# Altium schematic sheet CM5_Connectors.SchDoc: Example Template
size A4; CompanyName: University of Manchester; Engineer: Sam Walsh; Organization: University of Manchester; Address1: L3, 12a Rodborough Rd; Address2: Frenchs Forest; Address3: NSW; Address4: Australia 2086; DocumentNumber: 1; Revision: 0; SheetNumber: 7; SheetTotal: 8; Scale: Ratio
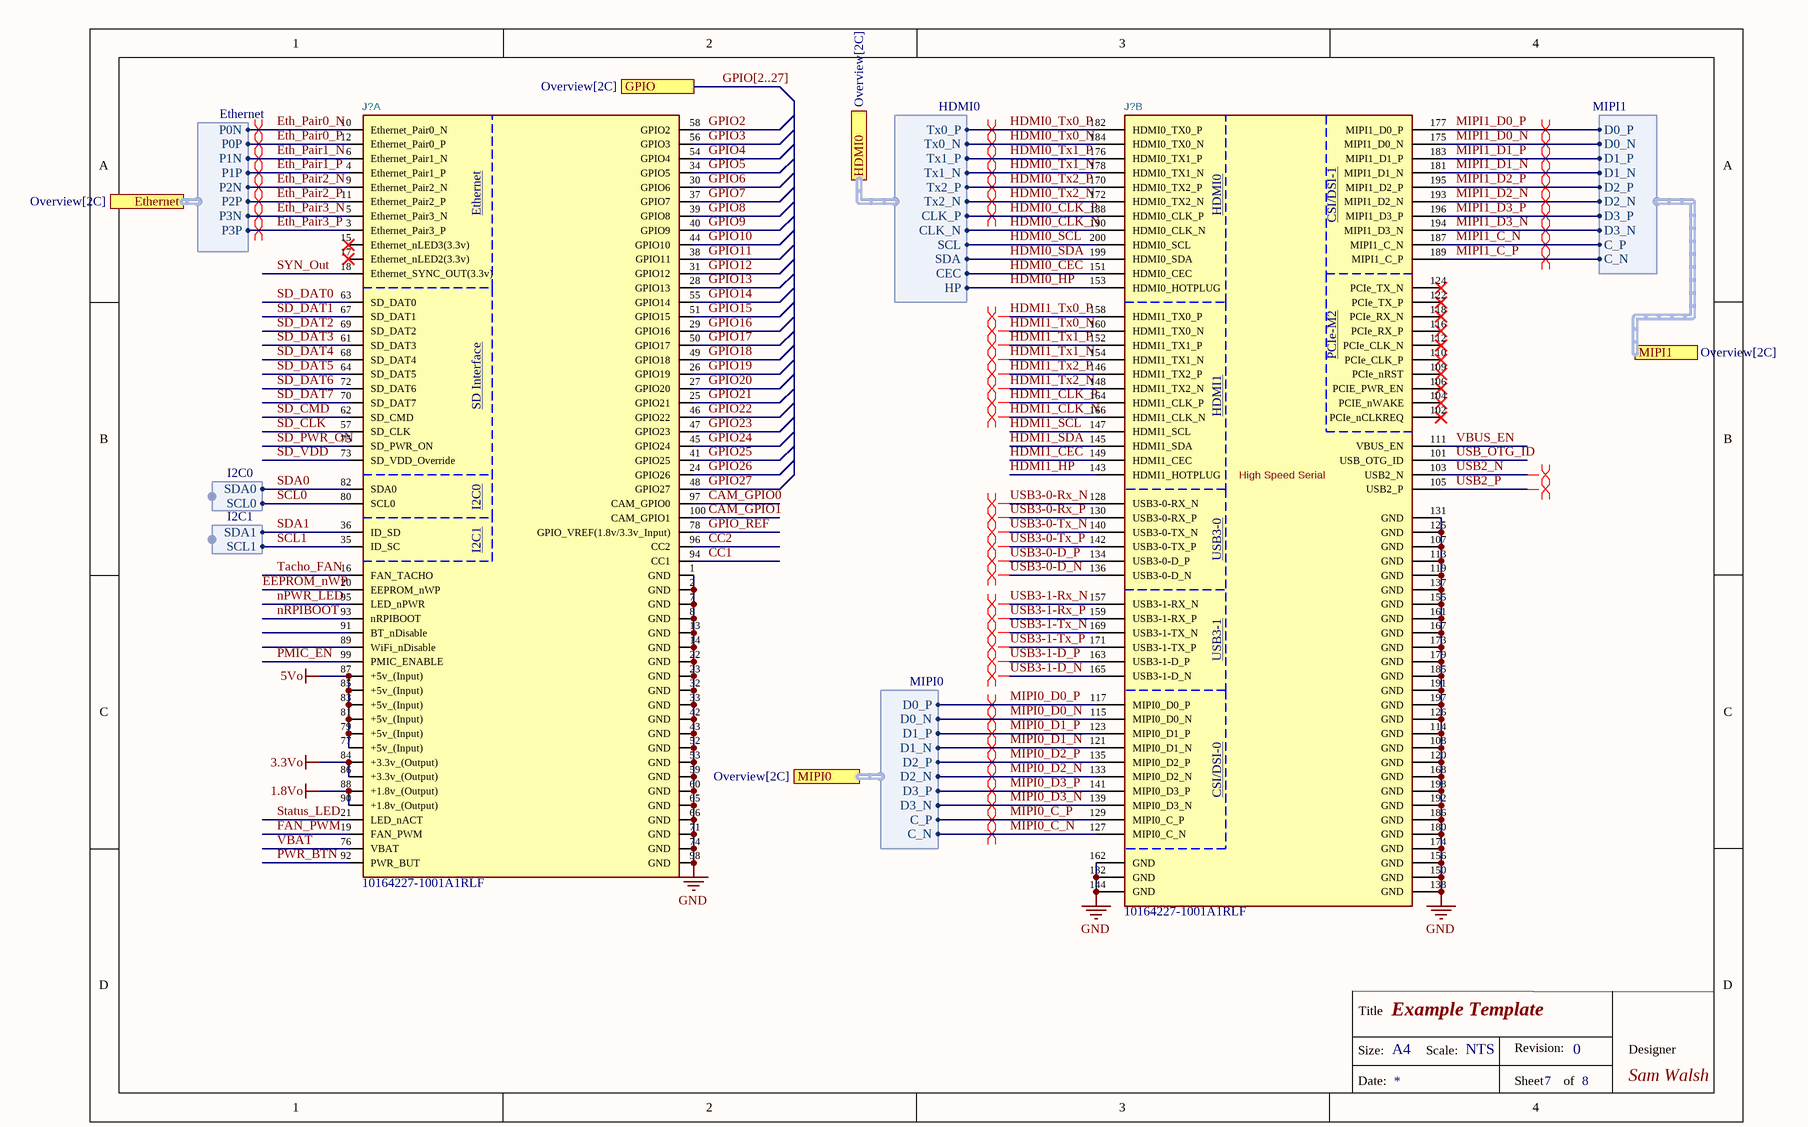
[diagram p0: CM5_Connectors.SchDoc]

## Parts
(Parts that share a designator on the sheet are numbered #1, #2 ... from top to bottom, then left to right.)
J?#1  10164227-1001A1RLF  [Raspberry-Pi-5-Compute-Module]  (part A of 2)
J?#2  10164227-1001A1RLF  [Raspberry-Pi-5-Compute-Module]  (part B of 2)

## Ports
Ethernet (harness Ethernet, see Overview[2C]), GPIO (see Overview[2C]), HDMI0 (harness HDMI0, see Overview[2C]), MIPI0 (harness MIPI0, see Overview[2C]), MIPI1 (harness MIPI1, see Overview[2C])

## Harnesses
MIPI0: D0_P, D0_N, D1_P, D1_N, D2_P, D2_N, D3_P, D3_N, C_P, C_N
MIPI1: D0_P, D0_N, D1_P, D1_N, D2_P, D2_N, D3_P, D3_N, C_P, C_N
HDMI0: Tx0_P, Tx1_N, Tx1_P, Tx2_P, CLK_N, CLK_P, SCL, CEC, HP, Tx2_N, Tx0_N, SDA
I2C0: SDA0, SCL0
I2C1: SDA1, SCL1
Ethernet: P0N, P0P, P1N, P1P, P2N, P2P, P3N, P3P

## Nets
1.8Vo: J?#1.88(+1.8v_(Output)) J?#1.90(+1.8v_(Output))
3.3Vo: J?#1.84(+3.3v_(Output)) J?#1.86(+3.3v_(Output))
5Vo: J?#1.77(+5v_(Input)) J?#1.79(+5v_(Input)) J?#1.81(+5v_(Input)) J?#1.83(+5v_(Input)) J?#1.85(+5v_(Input)) J?#1.87(+5v_(Input))
GND: J?#1.1(GND) J?#1.2(GND) J?#1.7(GND) J?#1.8(GND) J?#1.13(GND) J?#1.14(GND) J?#1.22(GND) J?#1.23(GND) J?#1.32(GND) J?#1.33(GND) J?#1.42(GND) J?#1.43(GND) J?#1.52(GND) J?#1.53(GND) J?#1.59(GND) J?#1.60(GND) J?#1.65(GND) J?#1.66(GND) J?#1.71(GND) J?#1.74(GND) J?#1.98(GND) J?#2.107(GND) J?#2.108(GND) J?#2.113(GND) J?#2.114(GND) J?#2.119(GND) J?#2.120(GND) J?#2.125(GND) J?#2.126(GND) J?#2.131(GND) J?#2.132(GND) J?#2.137(GND) J?#2.138(GND) J?#2.144(GND) J?#2.150(GND) J?#2.155(GND) J?#2.156(GND) J?#2.161(GND) J?#2.162(GND) J?#2.167(GND) J?#2.168(GND) J?#2.173(GND) J?#2.174(GND) J?#2.179(GND) J?#2.180(GND) J?#2.185(GND) J?#2.186(GND) J?#2.191(GND) J?#2.192(GND) J?#2.197(GND) J?#2.198(GND)
CAM_GPIO0: J?#1.97(CAM_GPIO0)
CAM_GPIO1: J?#1.100(CAM_GPIO1)
CC1: J?#1.94(CC1)
CC2: J?#1.96(CC2)
EEPROM_nWP: J?#1.20(EEPROM_nWP)
Eth_Pair0_N: J?#1.10(Ethernet_Pair0_N) ; port Ethernet.P0N
Eth_Pair0_P: J?#1.12(Ethernet_Pair0_P) ; port Ethernet.P0P
Eth_Pair1_N: J?#1.6(Ethernet_Pair1_N) ; port Ethernet.P1N
Eth_Pair1_P: J?#1.4(Ethernet_Pair1_P) ; port Ethernet.P1P
Eth_Pair2_N: J?#1.9(Ethernet_Pair2_N) ; port Ethernet.P2N
Eth_Pair2_P: J?#1.11(Ethernet_Pair2_P) ; port Ethernet.P2P
Eth_Pair3_N: J?#1.5(Ethernet_Pair3_N) ; port Ethernet.P3N
Eth_Pair3_P: J?#1.3(Ethernet_Pair3_P) ; port Ethernet.P3P
FAN_PWM: J?#1.19(FAN_PWM)
GPIO2: J?#1.58(GPIO2)
GPIO3: J?#1.56(GPIO3)
GPIO4: J?#1.54(GPIO4)
GPIO5: J?#1.34(GPIO5)
GPIO6: J?#1.30(GPIO6)
GPIO7: J?#1.37(GPIO7)
GPIO8: J?#1.39(GPIO8)
GPIO9: J?#1.40(GPIO9)
GPIO10: J?#1.44(GPIO10)
GPIO11: J?#1.38(GPIO11)
GPIO12: J?#1.31(GPIO12)
GPIO13: J?#1.28(GPIO13)
GPIO14: J?#1.55(GPIO14)
GPIO15: J?#1.51(GPIO15)
GPIO16: J?#1.29(GPIO16)
GPIO17: J?#1.50(GPIO17)
GPIO18: J?#1.49(GPIO18)
GPIO19: J?#1.26(GPIO19)
GPIO20: J?#1.27(GPIO20)
GPIO21: J?#1.25(GPIO21)
GPIO22: J?#1.46(GPIO22)
GPIO23: J?#1.47(GPIO23)
GPIO24: J?#1.45(GPIO24)
GPIO25: J?#1.41(GPIO25)
GPIO26: J?#1.24(GPIO26)
GPIO27: J?#1.48(GPIO27)
GPIO_REF: J?#1.78(GPIO_VREF(1.8v/3.3v_Input))
HDMI0_CEC: J?#2.151(HDMI0_CEC) ; port HDMI0.CEC
HDMI0_CLK_N: J?#2.190(HDMI0_CLK_N) ; port HDMI0.CLK_N
HDMI0_CLK_P: J?#2.188(HDMI0_CLK_P) ; port HDMI0.CLK_P
HDMI0_HP: J?#2.153(HDMI0_HOTPLUG) ; port HDMI0.HP
HDMI0_SCL: J?#2.200(HDMI0_SCL) ; port HDMI0.SCL
HDMI0_SDA: J?#2.199(HDMI0_SDA) ; port HDMI0.SDA
HDMI0_Tx0_N: J?#2.184(HDMI0_TX0_N) ; port HDMI0.Tx0_N
HDMI0_Tx0_P: J?#2.182(HDMI0_TX0_P) ; port HDMI0.Tx0_P
HDMI0_Tx1_N: J?#2.178(HDMI0_TX1_N) ; port HDMI0.Tx1_N
HDMI0_Tx1_P: J?#2.176(HDMI0_TX1_P) ; port HDMI0.Tx1_P
HDMI0_Tx2_N: J?#2.172(HDMI0_TX2_N) ; port HDMI0.Tx2_N
HDMI0_Tx2_P: J?#2.170(HDMI0_TX2_P) ; port HDMI0.Tx2_P
HDMI1_CEC: J?#2.149(HDMI1_CEC)
HDMI1_CLK_N: J?#2.166(HDMI1_CLK_N)
HDMI1_CLK_P: J?#2.164(HDMI1_CLK_P)
HDMI1_HP: J?#2.143(HDMI1_HOTPLUG)
HDMI1_SCL: J?#2.147(HDMI1_SCL)
HDMI1_SDA: J?#2.145(HDMI1_SDA)
HDMI1_Tx0_N: J?#2.160(HDMI1_TX0_N)
HDMI1_Tx0_P: J?#2.158(HDMI1_TX0_P)
HDMI1_Tx1_N: J?#2.154(HDMI1_TX1_N)
HDMI1_Tx1_P: J?#2.152(HDMI1_TX1_P)
HDMI1_Tx2_N: J?#2.148(HDMI1_TX2_N)
HDMI1_Tx2_P: J?#2.146(HDMI1_TX2_P)
MIPI0_C_N: J?#2.127(MIPI0_C_N) ; port MIPI0.C_N
MIPI0_C_P: J?#2.129(MIPI0_C_P) ; port MIPI0.C_P
MIPI0_D0_N: J?#2.115(MIPI0_D0_N) ; port MIPI0.D0_N
MIPI0_D0_P: J?#2.117(MIPI0_D0_P) ; port MIPI0.D0_P
MIPI0_D1_N: J?#2.121(MIPI0_D1_N) ; port MIPI0.D1_N
MIPI0_D1_P: J?#2.123(MIPI0_D1_P) ; port MIPI0.D1_P
MIPI0_D2_N: J?#2.133(MIPI0_D2_N) ; port MIPI0.D2_N
MIPI0_D2_P: J?#2.135(MIPI0_D2_P) ; port MIPI0.D2_P
MIPI0_D3_N: J?#2.139(MIPI0_D3_N) ; port MIPI0.D3_N
MIPI0_D3_P: J?#2.141(MIPI0_D3_P) ; port MIPI0.D3_P
MIPI1_C_N: J?#2.187(MIPI1_C_N) ; port MIPI1.C_P
MIPI1_C_P: J?#2.189(MIPI1_C_P) ; port MIPI1.C_N
MIPI1_D0_N: J?#2.175(MIPI1_D0_N) ; port MIPI1.D0_N
MIPI1_D0_P: J?#2.177(MIPI1_D0_P) ; port MIPI1.D0_P
MIPI1_D1_N: J?#2.181(MIPI1_D1_N) ; port MIPI1.D1_N
MIPI1_D1_P: J?#2.183(MIPI1_D1_P) ; port MIPI1.D1_P
MIPI1_D2_N: J?#2.193(MIPI1_D2_N) ; port MIPI1.D2_N
MIPI1_D2_P: J?#2.195(MIPI1_D2_P) ; port MIPI1.D2_P
MIPI1_D3_N: J?#2.194(MIPI1_D3_N) ; port MIPI1.D3_N
MIPI1_D3_P: J?#2.196(MIPI1_D3_P) ; port MIPI1.D3_P
nPWR_LED: J?#1.95(LED_nPWR)
nRPIBOOT: J?#1.93(nRPIBOOT)
PMIC_EN: J?#1.99(PMIC_ENABLE)
PWR_BTN: J?#1.92(PWR_BUT)
SCL0: J?#1.80(SCL0) ; harness I2C0.SCL0
SCL1: J?#1.35(ID_SC) ; harness I2C1.SCL1
SD_CLK: J?#1.57(SD_CLK)
SD_CMD: J?#1.62(SD_CMD)
SD_DAT0: J?#1.63(SD_DAT0)
SD_DAT1: J?#1.67(SD_DAT1)
SD_DAT2: J?#1.69(SD_DAT2)
SD_DAT3: J?#1.61(SD_DAT3)
SD_DAT4: J?#1.68(SD_DAT4)
SD_DAT5: J?#1.64(SD_DAT5)
SD_DAT6: J?#1.72(SD_DAT6)
SD_DAT7: J?#1.70(SD_DAT7)
SD_PWR_ON: J?#1.75(SD_PWR_ON)
SD_VDD: J?#1.73(SD_VDD_Override)
SDA0: J?#1.82(SDA0) ; harness I2C0.SDA0
SDA1: J?#1.36(ID_SD) ; harness I2C1.SDA1
Status_LED: J?#1.21(LED_nACT)
SYN_Out: J?#1.18(Ethernet_SYNC_OUT(3.3v))
Tacho_FAN: J?#1.16(FAN_TACHO)
USB2_N: J?#2.103(USB2_N)
USB2_P: J?#2.105(USB2_P)
USB3-0-D_N: J?#2.136(USB3-0-D_N)
USB3-0-D_P: J?#2.134(USB3-0-D_P)
USB3-0-Rx_N: J?#2.128(USB3-0-RX_N)
USB3-0-Rx_P: J?#2.130(USB3-0-RX_P)
USB3-0-Tx_N: J?#2.140(USB3-0-TX_N)
USB3-0-Tx_P: J?#2.142(USB3-0-TX_P)
USB3-1-D_N: J?#2.165(USB3-1-D_N)
USB3-1-D_P: J?#2.163(USB3-1-D_P)
USB3-1-Rx_N: J?#2.157(USB3-1-RX_N)
USB3-1-Rx_P: J?#2.159(USB3-1-RX_P)
USB3-1-Tx_N: J?#2.169(USB3-1-TX_N)
USB3-1-Tx_P: J?#2.171(USB3-1-TX_P)
USB_OTG_ID: J?#2.101(USB_OTG_ID)
VBAT: J?#1.76(VBAT)
VBUS_EN: J?#2.111(VBUS_EN)

Not connected (* = marked no-connect by the designer): J?#1 15(Ethernet_nLED3(3.3v))* 17(Ethernet_nLED2(3.3v))* 89(WiFi_nDisable) 91(BT_nDisable); J?#2 102(PCIe_nCLKREQ)* 104(PCIE_nWAKE)* 106(PCIE_PWR_EN)* 109(PCIe_nRST)* 110(PCIe_CLK_P)* 112(PCIe_CLK_N)* 116(PCIe_RX_P)* 118(PCIe_RX_N)* 122(PCIe_TX_P)* 124(PCIe_TX_N)*

## Buses and harness runs
bus GPIO[2..27] = port GPIO

## Layout directives
differential pair: Eth_Pair0_N, Eth_Pair0_P, Eth_Pair1_N, Eth_Pair1_P, Eth_Pair2_N, Eth_Pair2_P, Eth_Pair3_N, Eth_Pair3_P, HDMI0_CLK_P, HDMI0_Tx0_N, HDMI0_Tx0_P, HDMI0_Tx1_N, HDMI0_Tx1_P, HDMI0_Tx2_N, HDMI0_Tx2_P, HDMI1_CLK_N, HDMI1_CLK_P, HDMI1_Tx0_N, HDMI1_Tx0_P, HDMI1_Tx1_N, HDMI1_Tx1_P, HDMI1_Tx2_N, HDMI1_Tx2_P, MIPI0_C_N, MIPI0_C_P, MIPI0_D0_N, MIPI0_D0_P, MIPI0_D1_N, MIPI0_D1_P, MIPI0_D2_N, MIPI0_D2_P, MIPI0_D3_N, MIPI0_D3_P, MIPI1_C_N, MIPI1_C_P, MIPI1_D0_N, MIPI1_D0_P, MIPI1_D1_N, MIPI1_D1_P, MIPI1_D2_N, MIPI1_D2_P, MIPI1_D3_N, MIPI1_D3_P, USB2_N, USB2_P, USB3-0-D_N, USB3-0-D_P, USB3-0-Rx_N, USB3-0-Rx_P, USB3-0-Tx_N, USB3-0-Tx_P, USB3-1-D_N, USB3-1-D_P, USB3-1-Rx_N, USB3-1-Rx_P, USB3-1-Tx_N, USB3-1-Tx_P

## Notes on the sheet
- Size:
- Title
- A4
- Scale:
- NTS
- Revision:
- Designer
- Date:
- Sheet
- of
- (in symbol ComputeModule5-CM5, part A) Ethernet; SD Interface; I2C0; I2C1
- (in symbol ComputeModule5-CM5, part B) HDMI0; CSI/DSI-1; PCIe-M2; HDMI1; High Speed Serial; USB3-0; USB3-1; CSI/DSI-0

## Library data of the parts
J?#1 J?#2 = ComputeModule5-CM5: RaspberryPi Compute module 5; Footprint: CM5IO:Raspberry-Pi-5-Compute-Module; Mft PN: 10164227-1001A1RLF; Description_: RaspberryPi Compute module 5